# Altium schematic sheet GPIO.SchDoc
size A4
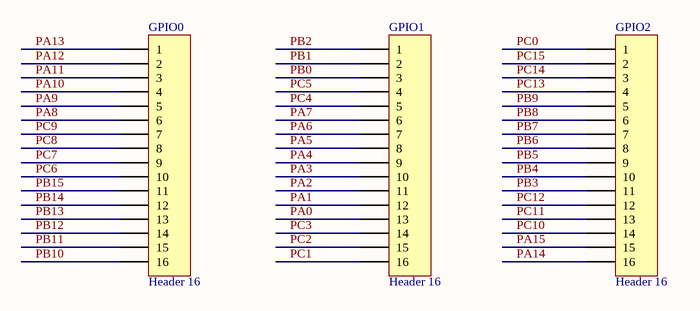
[diagram p0: GPIO.SchDoc]

## Parts
GPIO0  Header 16  [HDR1X16]
GPIO1  Header 16  [HDR1X16]
GPIO2  Header 16  [HDR1X16]

## Nets
PA0: GPIO1.13
PA1: GPIO1.12
PA2: GPIO1.11
PA3: GPIO1.10
PA4: GPIO1.9
PA5: GPIO1.8
PA6: GPIO1.7
PA7: GPIO1.6
PA8: GPIO0.6
PA9: GPIO0.5
PA10: GPIO0.4
PA11: GPIO0.3
PA12: GPIO0.2
PA13: GPIO0.1
PA14: GPIO2.16
PA15: GPIO2.15
PB0: GPIO1.3
PB1: GPIO1.2
PB2: GPIO1.1
PB3: GPIO2.11
PB4: GPIO2.10
PB5: GPIO2.9
PB6: GPIO2.8
PB7: GPIO2.7
PB8: GPIO2.6
PB9: GPIO2.5
PB10: GPIO0.16
PB11: GPIO0.15
PB12: GPIO0.14
PB13: GPIO0.13
PB14: GPIO0.12
PB15: GPIO0.11
PC0: GPIO2.1
PC1: GPIO1.16
PC2: GPIO1.15
PC3: GPIO1.14
PC4: GPIO1.5
PC5: GPIO1.4
PC6: GPIO0.10
PC7: GPIO0.9
PC8: GPIO0.8
PC9: GPIO0.7
PC10: GPIO2.14
PC11: GPIO2.13
PC12: GPIO2.12
PC13: GPIO2.4
PC14: GPIO2.3
PC15: GPIO2.2

## Library data of the parts
GPIO0-GPIO2 = Header 16: Header, 16-Pin; LatestRevisionDate: 17-Jul-2002; LatestRevisionNote: Re-released for DXP Platform.; Publisher: Altium Limited